# Altium schematic sheet Fei-Fei.SchDoc
size 420 x 297 mm; SheetNumber: 1; SheetTotal: 1
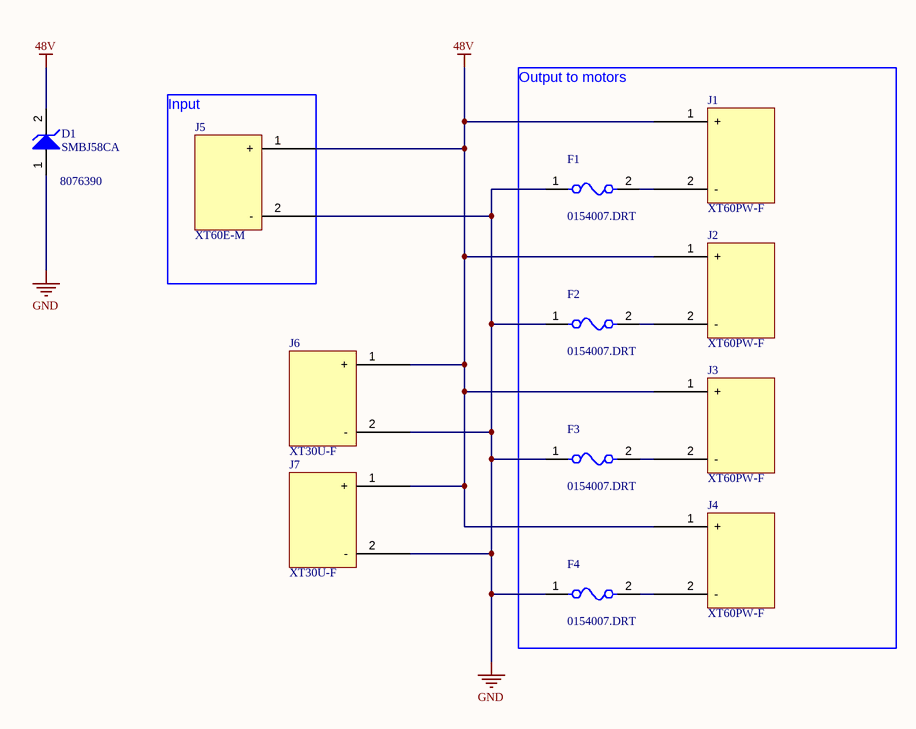
[diagram p0: Fei-Fei.SchDoc]

## Parts
D1  SMBJ58CA  Supplier Part Number 2: 8076390  [DO-214AA]
F1  0154007.DRT  [FP-0154-MFG]
F2  0154007.DRT  [FP-0154-MFG]
F3  0154007.DRT  [FP-0154-MFG]
F4  0154007.DRT  [FP-0154-MFG]
J1  XT60PW-F  [XT60PW_F]
J2  XT60PW-F  [XT60PW_F]
J3  XT60PW-F  [XT60PW_F]
J4  XT60PW-F  [XT60PW_F]
J5  XT60E-M  [XT60E-M]
J6  XT30U-F  [XT30U-F]
J7  XT30U-F  [XT30U-F]

## Nets
48V: D1.2(K) J1.1(+) J2.1(+) J3.1(+) J4.1(+) J5.1(+) J6.1(+) J7.1(+)
GND: D1.1(A) F1.1 F2.1 F3.1 F4.1 J5.2(-) J6.2(-) J7.2(-)
NetF1_2: F1.2 J1.2(-)
NetF2_2: F2.2 J2.2(-)
NetF3_2: F3.2 J3.2(-)
NetF4_2: F4.2 J4.2(-)

## Notes on the sheet
- (near J5) Input
- Output to motors
- CREATIVE COMMONS
- PUBLIC LICENSE:
- BARKOUR ROBOT
- CC BY-NC 4.0
- APPROVED
- DWG NO
- GOOGLE LLC
- FILE
- RELEASED
- 2024/05/09
- SIZE
- 1600 AMPHITHEATRE PARKWAY
- MOUNTAIN VIEW CA 94043
- A3
- SHEET
- OF
- THIS DESIGN IS BEING PROVIDED  FOR NON-COMMERCIAL USE ONLY. THE USE OF =SCIENTIST_NAME_POSSESSIVE NAME IN CONNECTION WITH THE DESIGN IS NOT INTENDED TO IMPLY THAT =SCIENTIST_NAME SPONSORS OR ENDORSES THE DESIGN, GOOGLE LLC, OR ANY OF GOOGLE LLC'S PRODUCTS OR SERVICES.

## Library data of the parts
D1 = SMBJ48A-13-F: Diode TVS Single Bi-Dir 58V 600W 2-Pin SMB; Manufacturer: Diodes Incorporated; Manufacturer Part Number: SMBJ54A-13-F; Value: SMBJ58CA; Supplier 1: Digikey; Supplier Part Number 1: SMBJ54A-FDICT-ND; Supplier 2: Future Electronics; RoHS: Yes; Category: TVS Diodes; Stock 2: 75000; Pricing 2: 3000=0.0728, 9000=0.07, 15000=0.0687, 30000=0.0671, 60000=0.0645 (USD); ComponentLink1URL: https://datasheet.ciiva.com/15143/getdatasheetpartid-57277-15143151.pdf?src-supplier=Verical; ComponentLink1Description: https://datasheet.ciiva.com/15143/getdatasheetpartid-57277-15143151.pdf?src-supplier=Verical; ComponentLink2URL: https://datasheet.ciiva.com/25624/0900766b810f4eeb-25624815.pdf?src-supplier=Rs; ComponentLink2Description: https://datasheet.ciiva.com/25624/0900766b810f4eeb-25624815.pdf?src-supplier=Rs; ComponentLink3URL: https://datasheet.ciiva.com/46427/1677318-46427999.pdf?src-supplier=Element14; ComponentLink3Description: https://datasheet.ciiva.com/46427/1677318-46427999.pdf?src-supplier=Element14; ComponentLink4URL: https://datasheet.ciiva.com/331/littelfuse-tvs-diode-smbj-datasheet-pdf-331664.pdf?src-supplier=Digi-Key; ComponentLink4Description: https://datasheet.ciiva.com/331/littelfuse-tvs-diode-smbj-datasheet-pdf-331664.pdf?src-supplier=Digi-Key; ComponentLink5URL: https://datasheet.ciiva.com/331/littelfuse-tvs-diode-smbj-datasheet-pdf-331665.pdf?src-supplier=Digi-Key; ComponentLink5Description: https://datasheet.ciiva.com/331/littelfuse-tvs-diode-smbj-datasheet-pdf-331665.pdf?src-supplier=Digi-Key; ComponentLink6URL: https://datasheet.ciiva.com/331/littelfuse-tvs-diode-smbj-datasheet-pdf-331666.pdf?src-supplier=Digi-Key; ComponentLink6Description: https://datasheet.ciiva.com/331/littelfuse-tvs-diode-smbj-datasheet-pdf-331666.pdf?src-supplier=Digi-Key; ComponentLink7URL: https://datasheet.ciiva.com/8062/littelfuse-tvs-diode-smbj-8062344.pdf?src-supplier=Element14; ComponentLink7Description: https://datasheet.ciiva.com/8062/littelfuse-tvs-diode-smbj-8062344.pdf?src-supplier=Element14
F1-F4 = CMP-08605-000019-1: FUSE BRD MNT 7A 72VAC 60VDC 2SMD; Manufacturer: Littelfuse Inc; Max Fuse Dc Voltage: 60V; Fuse Blow Speed: Slow; Max Fuse Ac Voltage: 72V; Manufacturer Part Number: 0154007.DRT; RoHS: TRUE; Temperature Range High: +125°C; Temperature: -55°C to +125°C; Digikey Description: FUSE BRD MNT 7A 72VAC 60VDC 2SMD; Device Class L3: unset; Package: 0154; Lead Free: Yes; Fuse Current: 7A; Temperature Range Low: -55°C; Automotive: No; Height: 3.81mm; Octopart: https://octopart.com/0154007.drt-littelfuse-19644006; Device Class L2: Fuses; Category: Fuse; ComponentLink2URL: https://www.littelfuse.com/~/media/electronics/datasheets/fuses/littelfuse_fuse_154_154t_154l_154tl_datasheet.pdf.pdf; ComponentLink2Description: Datasheet; Device Class L1: Circuit Protection; Mouser Description: Surface Mount Fuses ACS SMF OMNI-BLOK SB RoHS 7A
J1-J4 = XT60PW-F: Manufacturer Link: https://www.tme.eu/gb/details/xt60pw-f/dc-power-connectors/amass/?brutto=1&currency=GBP&gclid=Cj0KCQjwz8emBhDrARIsANNJjS53ShuwMtc7PxX_PGoXGRRVbNHpUt3m1mLshKeAqDpjTqScIuL4RFoaApfkEALw_wcB
J6 J7 = XT30U-F: Manufacturer Link: https://www.tme.eu/gb/details/xt60pw-f/dc-power-connectors/amass/?brutto=1&currency=GBP&gclid=Cj0KCQjwz8emBhDrARIsANNJjS53ShuwMtc7PxX_PGoXGRRVbNHpUt3m1mLshKeAqDpjTqScIuL4RFoaApfkEALw_wcB